# EAGLE design EBF31A production rev 3.1 (EAGLE 7.7.0)
Electronic Battery Feed Circuit taken from Altec 8480-2 by Clint Gilliland
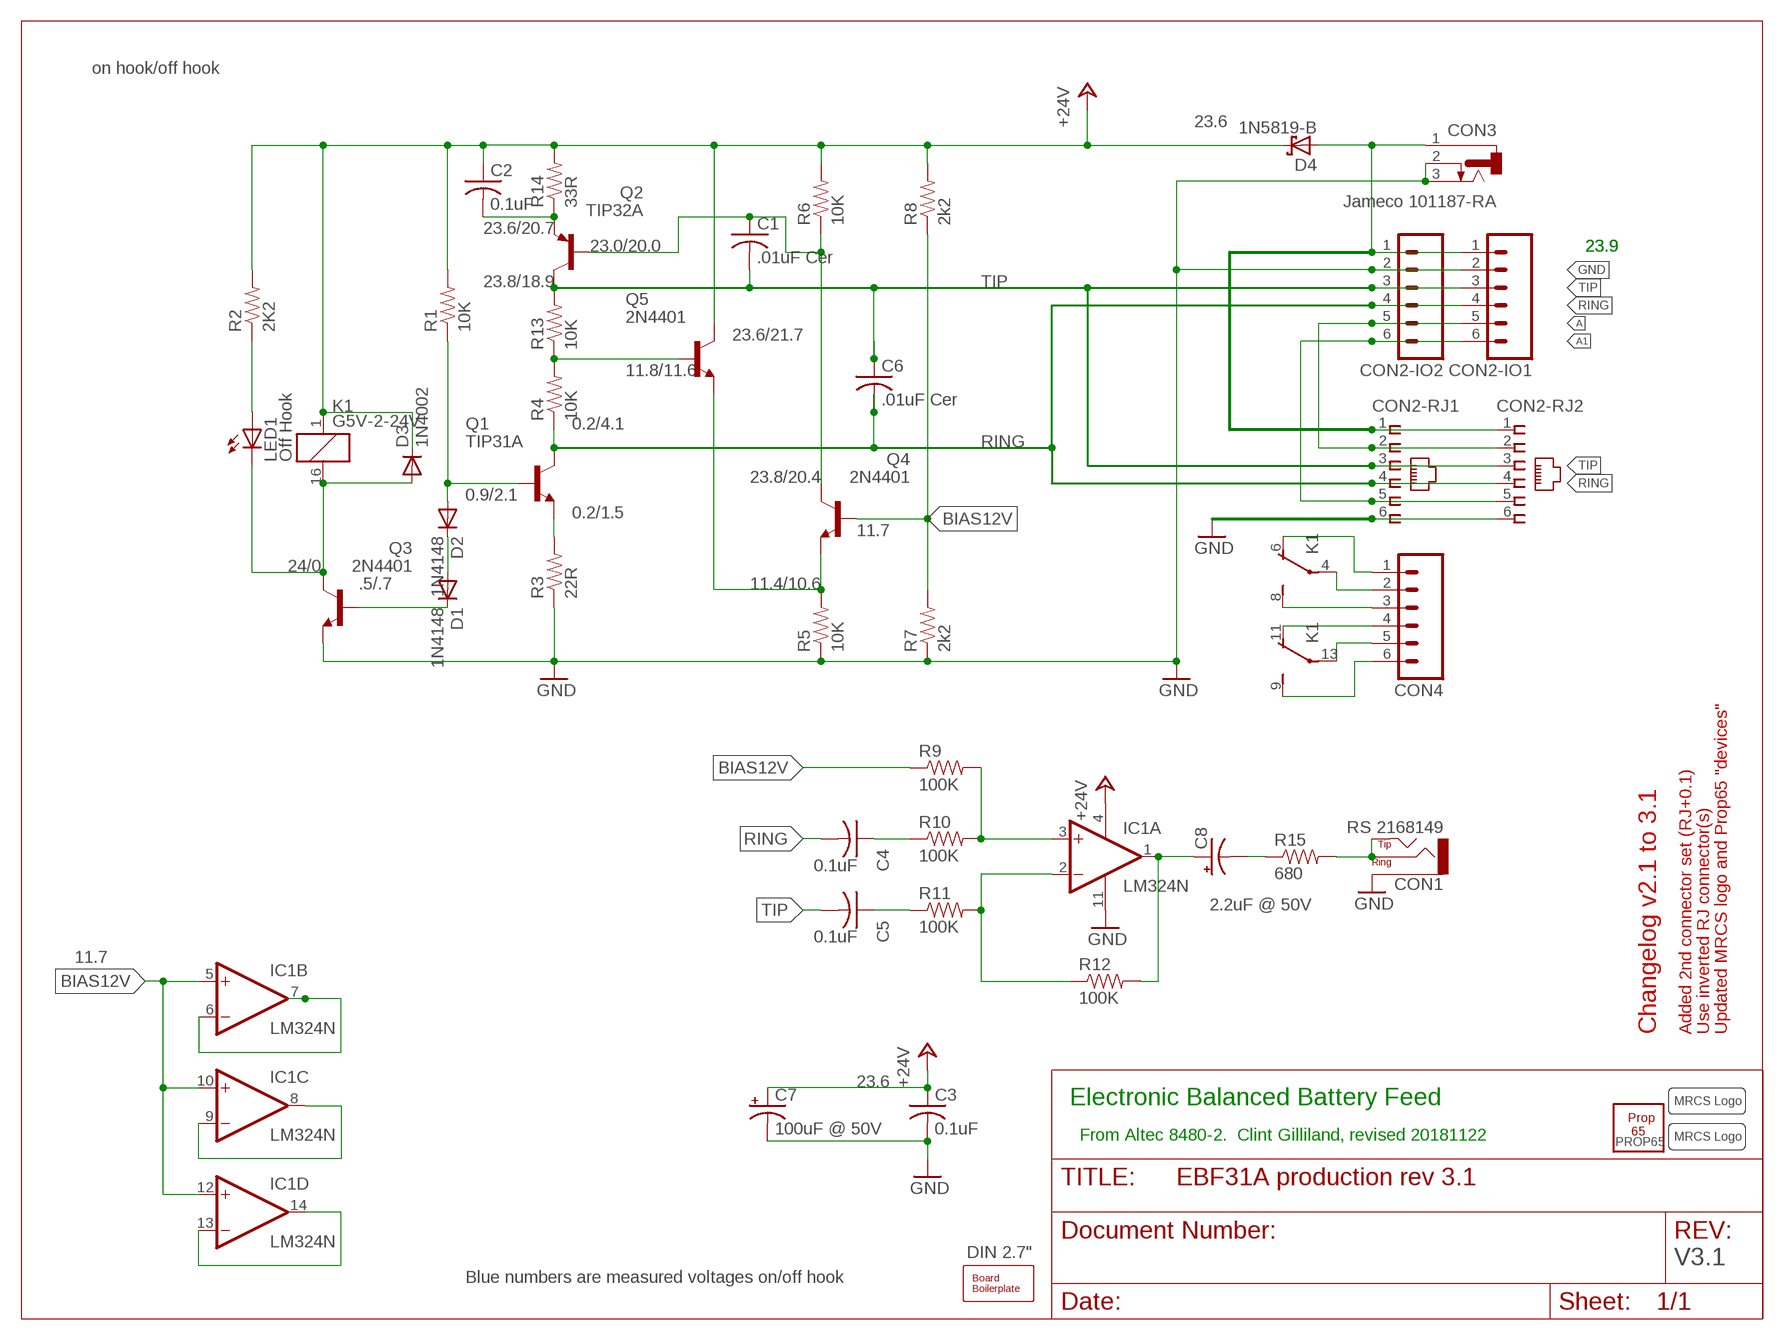
[diagram p0: schematic, sheet 1]

## Parts
C1  .01uF Cer  C-US025-030X050  [C025-030X050]
C2  0.1uF  C-US025-030X050  [C025-030X050]
C3  0.1uF  C-US025-030X050  [C025-030X050]
C4  0.1uF  C-US025-030X050  [C025-030X050]
C5  0.1uF  C-US025-030X050  [C025-030X050]
C6  .01uF Cer  C-US025-030X050  [C025-030X050]
C7  100uF @ 50V  CPOL-USE3.5-10  [E3,5-10]
C8  2.2uF @ 50V  CPOL-USE2-5  [E2-5]
CON1  RS 2168149  CONNECTOR-AUDIO3.5MM-ADAMTECH  [AUDIO-JACK-3.5MM_STEREO]
CON2-IO1  M06FEMALE_LOCK  [1X06_FEMALE_LOCK.010]
CON2-IO2  M06FEMALE_LOCK  [1X06_FEMALE_LOCK.010]
CON2-RJ1  CONNECTOR-RJ25-43860-2-MOLEX  [RJ25-INVERTED]
CON2-RJ2  CONNECTOR-RJ25-43860-2-MOLEX  [RJ25-INVERTED]
CON3  Jameco 101187-RA  CONNECTOR-DC-POWER-RA  [DCJ0202]
CON4  M06FEMALE_LOCK  [1X06_FEMALE_LOCK.010]
D1  1N4148  DIODE1N4148  [DIODE-1N4148]
D2  1N4148  DIODE1N4148  [DIODE-1N4148]
D3  1N4002  DIODE1N4148  [DIODE-1N4148]
D4  1N5819-B  [DO41-7.6]
IC1  LM324N  [DIL14]
K1  G5V-2-24V  G5V-2  [G5V-2]
LED1  Off Hook  LED3MM  [LED3MM]
Q1  TIP31A  TIP31C  [TO220]
Q2  TIP32A  TIP30  [TO220]
Q3  2N4401  BC317-NPN-TO92-EBC  [TO92-EBC]
Q4  2N4401  BC317-NPN-TO92-EBC  [TO92-EBC]
Q5  2N4401  BC317-NPN-TO92-EBC  [TO92-EBC]
R1  10K  RESISTORPTH-1/4W  [AXIAL-0.4]
R2  2K2  RESISTORPTH-1/4W  [AXIAL-0.4]
R3  22R  RESISTORPTH-1/4W  [AXIAL-0.4]
R4  10K  RESISTORPTH-1/4W  [AXIAL-0.4]
R5  10K  RESISTORPTH-1/4W  [AXIAL-0.4]
R6  10K  RESISTORPTH-1/4W  [AXIAL-0.4]
R7  2k2  RESISTORPTH-1/4W  [AXIAL-0.4]
R8  2k2  RESISTORPTH-1/4W  [AXIAL-0.4]
R9  100K  RESISTORPTH-1/4W  [AXIAL-0.4]
R10  100K  RESISTORPTH-1/4W  [AXIAL-0.4]
R11  100K  RESISTORPTH-1/4W  [AXIAL-0.4]
R12  100K  RESISTORPTH-1/4W  [AXIAL-0.4]
R13  10K  RESISTORPTH-1/4W  [AXIAL-0.4]
R14  33R  RESISTORPTH-1/4W  [AXIAL-0.4]
R15  680  RESISTORPTH-1/4W  [AXIAL-0.4]
U$1  BOARD  BOARD69X100MRCS  [BOARD-DINRAIL-2.71IN-MRCS]
U$2  MRCS-LOGOBOT-LARGE  [MRCS-LOGO]
U$3  MRCS-LOGOBOT-LARGE  [MRCS-LOGO]
U$4  PROP65  [PROP65]

## Nets
+24V: C2.1 C3.1 C7.+ D3.C D4.C IC1.4(P:V+) K1.1 Q5.C R1.P$2 R2.P$2 R6.P$2 R8.P$2 R14.P$2
A: CON2-IO1.5 CON2-IO2.5 CON2-RJ1.2 CON2-RJ2.2
A1: CON2-IO1.6 CON2-IO2.6 CON2-RJ1.5 CON2-RJ2.5
BIAS12V: IC1.5(B:+IN) IC1.10(C:+IN) IC1.12(D:+IN) Q4.B R7.P$2 R8.P$1 R9.P$1
GND: C3.2 C7.- CON1.GND(SLEEVE) CON2-IO1.2 CON2-IO2.2 CON2-RJ1.6 CON2-RJ2.6 CON3.2 CON3.3 IC1.11(P:V-) Q3.E R3.P$1 R5.P$1 R7.P$1
N$1: C2.2 Q2.3(E) R14.P$1
N$2: CON4.2 K1.4(1:P)
N$3: Q5.B R4.P$2 R13.P$1
N$4: IC1.2(A:-IN) R11.P$2 R12.P$1
N$5: Q1.3(E) R3.P$2
N$6: LED1.A R2.P$1
N$7: CON2-IO1.1 CON2-IO2.1 CON2-RJ1.1 CON2-RJ2.1 CON3.1 D4.A
N$8: Q4.E Q5.E R5.P$2
N$9: C1.1 Q2.1(B) Q4.C R6.P$1
N$10: D1.C Q3.B
N$11: D1.A D2.C
N$12: D2.A Q1.1(B) R1.P$1
N$13: D3.A K1.16 LED1.K(C) Q3.C
N$15: IC1.13(D:-IN) IC1.14(D:OUT)
N$16: CON4.6 K1.9(2:S)
N$17: CON4.1 K1.6(1:O)
N$18: CON4.3 K1.8(1:S)
N$19: C5.1 R11.P$1
N$20: C8.+ IC1.1(A:OUT) R12.P$2
N$21: CON4.5 K1.13(2:P)
N$22: IC1.6(B:-IN) IC1.7(B:OUT)
N$23: CON4.4 K1.11(2:O)
N$25: C8.- R15.P$1
N$27: CON1.RING CON1.TIP R15.P$2
N$28: IC1.3(A:+IN) R9.P$2 R10.P$2
N$31: C4.1 R10.P$1
N$33: IC1.8(C:OUT) IC1.9(C:-IN)
RING: C4.2 C6.2 CON2-IO1.4 CON2-IO2.4 CON2-RJ1.4 CON2-RJ2.4 Q1.2(C) R4.P$1
TIP: C1.2 C5.2 C6.1 CON2-IO1.3 CON2-IO2.3 CON2-RJ1.3 CON2-RJ2.3 Q2.2(C) R13.P$2

## Notes on the sheet
- on hook/off hook
- 23.6
- 23.6/20.7
- 23.0/20.0 | 23.9 | 23.9
- 23.8/18.9
- 23.6/21.7
- 11.8/11.6
- 0.2/4.1
- 23.8/20.4
- 0.9/2.1
- 0.2/1.5
- 11.7
- 24/0
- .5/.7 | 11.4/10.6
- 11.7
- Changelog v2.1 to 3.1 | Added 2nd connector set (RJ+0.1) | Use inverted RJ connector(s) | Updated MRCS logo and Prop65 "devices"
- 23.6
- Electronic Balanced Battery Feed
- From Altec 8480-2.  Clint Gilliland, revised 20181122
- DIN 2.7"
- V3.1
- Blue numbers are measured voltages on/off hook

## Library data of the parts
C1-C6 = rcl:C-US: CAPACITOR, American symbol
C7 C8 = rcl:CPOL-US: POLARIZED CAPACITOR, American symbol
CON1 = SPCoast:CONNECTOR-AUDIO: 3.5mm Audio Jack Simple 3.5mm common PCB mount audio jack. SKU: PRT-08032
CON2-IO1 CON2-IO2 CON4 = SparkFun-Connectors:M06: Header 6 Standard 6-pin 0.1" header. Use with straight break away headers (SKU : PRT-00116), right angle break away headers (PRT-00553), swiss pins (PRT-00743), machine pins (PRT-00117), and female headers (PRT-00115). Molex polarized connector foot print use with SKU : PRT-08094 with associated crimp pins and housings. NOTES ON THE VARIANTS LOCK and LOCK_LONGPADS... This footprint was designed to help hold the alignment of a through-hole component (i.e. 6-pin header) while soldering it into place. You may notice that each hole has been shifted either up or down by 0.005 of an inch from it's more standard position (which is a perfectly straight line). This slight alteration caused the pins (the squares in the middle) to touch the edges of the holes. Because they are alternating, it causes a "brace" to hold the component in place. 0.005 has proven to be the perfect amount of "off-center" position when using our standard breakaway headers. Although looks a little odd when you look at the bare footprint, once you have a header in there, the alteration is very hard to notice. Also,if you push a header all the way into place, it is covered up entirely on the bottom side. This idea of altering the position of holes to aid alignment will be further integrated into the Sparkfun Library for other footprints. It can help hold any component with 3 or more connection pins.
CON2-RJ1 CON2-RJ2 = SPCoast:CONNECTOR-RJ25: AMP connector
CON3 = SPCoast:CONNECTOR-DC-POWER: DC POWER JACK Source: DCJ0202.pdf
D1-D3 = SparkFun-DiscreteSemi:DIODE: Diode These are standard reverse protection diodes and small signal diodes. SMA package can handle up to about 1A. SOD-323 can handle about 200mA. What the SOD-323 package when ordering, there are some mfgs out there that are 5-pin packages.
D4 = diode:1N581*: 1.0A SCHOTTKY BARRIER RECTIFIER Source: http://www.diodes.com/datasheets/ds23001.pdf
IC1 = linear:LM324: OP AMP
K1 = relay:G5V-2: OMRON PCB Relay Source: http://www.omron.com/ecb/products/pdf/en-g5v2.pdf; MPN: G5V-2 5DC; OC_FARNELL: 9949488; OC_NEWARK: 78K5703
LED1 = SparkFun-LED:LED: LEDs Standard schematic elements and footprints for 5mm, 3mm, 1206, and 0603 sized LEDs. 5mm - Spark Fun Electronics SKU : COM-00529 (and others)
Q1 = transistor-npn:TIP31C*: NPN Transistor
Q2 = transistor-pnp:TIP30: PNP Transistor
Q3-Q5 = SPCoast:*-NPN-: NPN Transistror BF959 corrected 2008.03.06
R1-R15 = SparkFun-Resistors:RESISTOR: Resistor Basic schematic elements and footprints for 0603, 1206, and PTH resistors.
U$1 = SPCoast:BOARD
U$2 U$3 = SPCoast:MRCS-LOGO
U$4 = SPCoast:PROP65

## Board
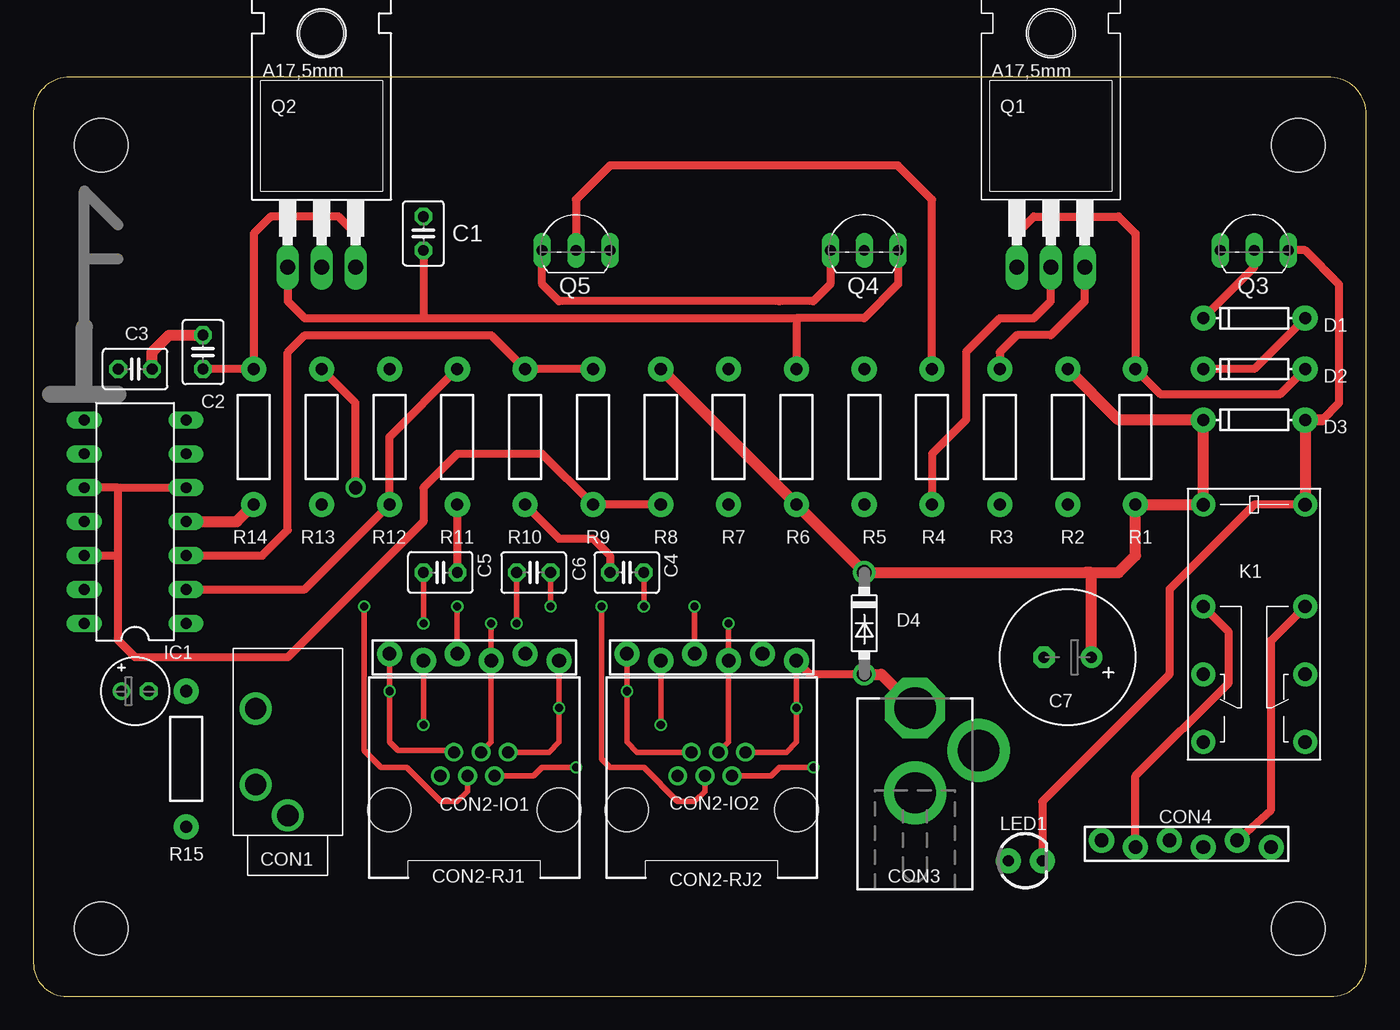
[diagram p1: board, top side]
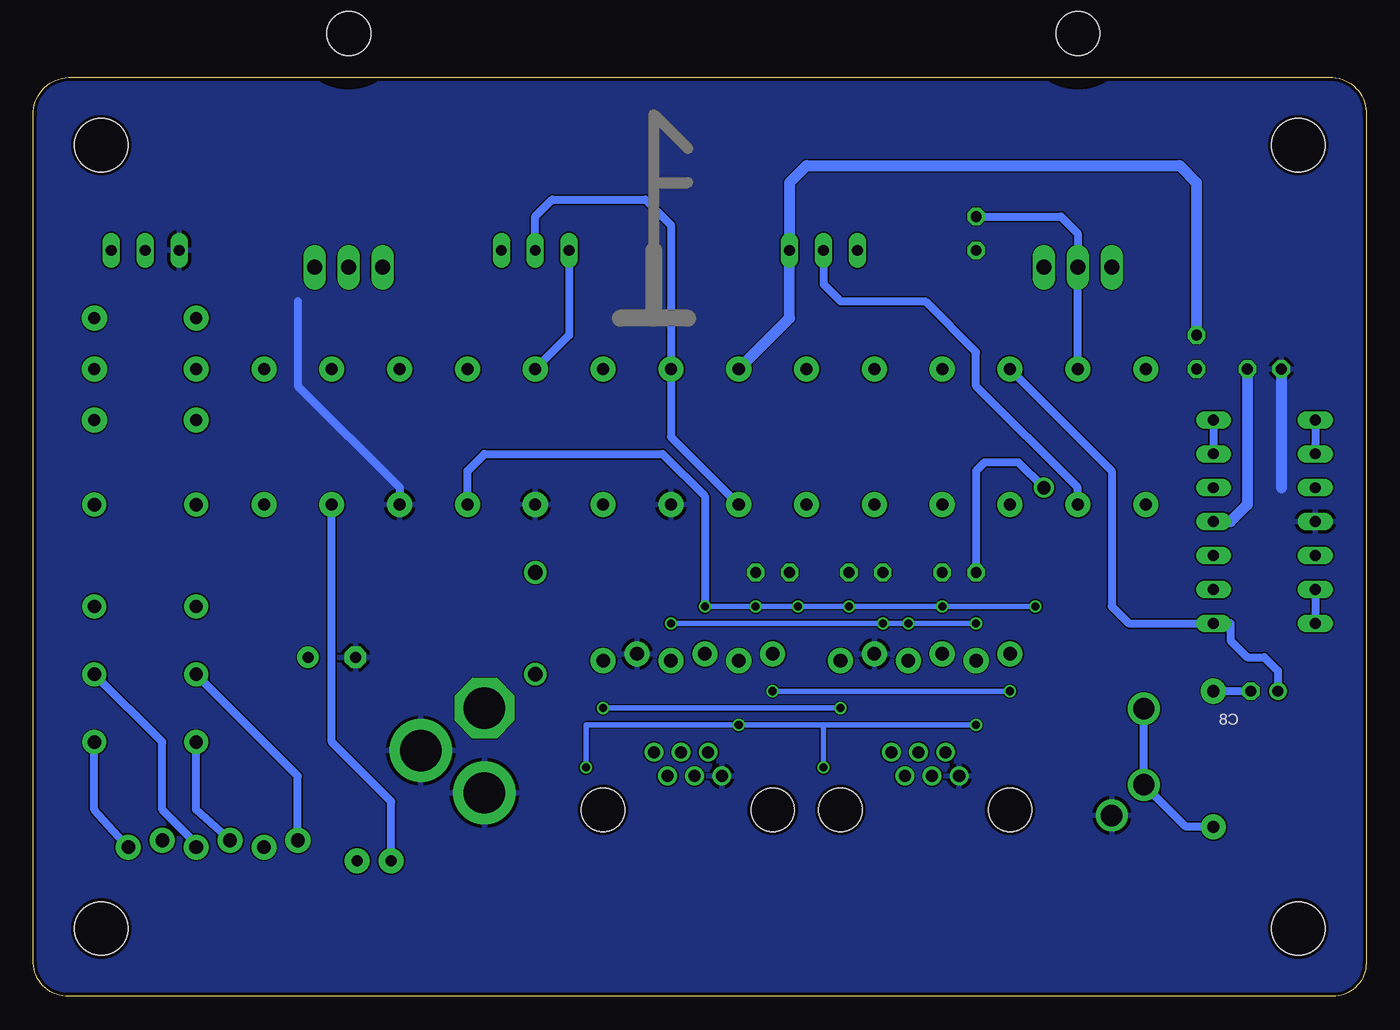
[diagram p2: board, bottom side, seen from below]

Size 99.82 x 68.83 mm. Coordinates in mm from the lower left corner, seen from the top.
Copper layers (1*16): Top 0.035mm / dielectric 1.5mm / Bottom 0.035mm
Design rules "SeeedStudio_2layer_DRU_no_angle_2018-plocher": minimum track width 6mil, minimum drill 12mil, track to track 4mil, track to pad 4mil, pad to pad 12mil, via to via 12mil, smd to smd 0mil, copper to edge 10mil, drill to drill 10mil, minimum pad ring 10mil, minimum via ring 6mil, stop-mask expansion 2mil, vias tented up to drill 100mil, thermal gap 10mil

### Footprints (pad centres in the part's own frame; a part is rotated, then mirrored left to right if it is on the bottom)
C025-030X050 = drill 0.813 octagon: 1 -1.27,0; 2 1.27,0
E3,5-10 = drill 0.813 pad 1.6: + -1.778,0 | drill 0.813 pad 1.6 octagon: - 1.778,0
E2-5 = drill 0.813 pad 1.27: + -1.016,0 | drill 0.813 pad 1.27 octagon: - 1.016,0
AUDIO-JACK-3.5MM_STEREO = drill 1.6: GND -5.5,0; RING 2.5,2.4; TIP -3.2,2.4
1X06_FEMALE_LOCK.010 = drill 1.016 pad 1.88: 1 0,0.254; 2 2.54,-0.254; 3 5.08,0.254; 4 7.62,-0.254; 5 10.16,0.254; 6 12.7,-0.254
RJ25-INVERTED = drill 0.9 pad 1.4: 1 2.54,4.318; 2 1.524,2.54; 3 0.508,4.318; 4 -0.508,2.54; 5 -1.524,4.318; 6 -2.54,2.54 | hole 3.251: -6.35,0; 6.35,0
DCJ0202 = drill 3.1 pad 4.5 octagon: 1 0,3.175 | drill 3.1 pad 4.7: 2 4.763,0; 3 0,-3.175
DIODE-1N4148 = drill 0.9 pad 1.88: A -3.81,0; C 3.81,0
DO41-7.6 = drill 1.1 pad 1.7: A 3.81,0; C -3.81,0
DIL14 = drill 0.813 long: 1 -7.62,-3.81; 2 -5.08,-3.81; 3 -2.54,-3.81; 4 0,-3.81; 5 2.54,-3.81; 6 5.08,-3.81; 7 7.62,-3.81; 8 7.62,3.81; 9 5.08,3.81; 10 2.54,3.81; 11 0,3.81; 12 -2.54,3.81; 13 -5.08,3.81; 14 -7.62,3.81
G5V-2 = drill 1 pad 1.8: 1 -8.89,-3.81; 4 -1.27,-3.81; 6 3.81,-3.81; 8 8.89,-3.81; 9 8.89,3.81; 11 3.81,3.81; 13 -1.27,3.81; 16 -8.89,3.81
LED3MM = drill 0.813 pad 1.88: A -1.27,0; K 1.27,0
TO220 = drill 1.118 long: 1 -2.54,-6.35; 2 0,-6.35; 3 2.54,-6.35 | hole 3.302: 0,11.176
TO92-EBC = drill 0.813 long: B 0,-1.27; C 2.54,-1.27; E -2.54,-1.27
AXIAL-0.4 = drill 0.9 pad 1.88: P$1 -5.08,0; P$2 5.08,0
BOARD-DINRAIL-2.71IN-MRCS = hole 4: 94.742,5.08; 5.08,63.754; 94.742,63.754; 5.08,5.08

### Placement (x,y rotation side)
C1  29.21,57.15 90 top
C2  12.7,48.26 270 top
C3  7.62,46.99 180 top
C4  44.45,31.75 0 top
C5  30.48,31.75 180 top
C6  37.47,31.75 0 top
C7  77.47,25.4 180 top
C8  7.62,22.86 0 top
CON1  19.05,19.05 90 top
CON2-IO1  39.37,25.4 180 top
CON2-IO2  57.15,25.4 180 top
CON2-RJ1  33.02,13.97 0 top
CON2-RJ2  50.8,13.97 0 top
CON3  66.04,18.41 0 top
CON4  80.01,11.43 0 top
D1  91.44,50.8 180 top
D2  91.44,46.99 180 top
D3  91.44,43.18 180 top
D4  62.23,27.94 270 top
IC1  7.62,35.56 90 top
K1  91.44,27.94 270 top
LED1  74.3,10.16 0 top
Q1  76.2,60.96 0 top
Q2  21.59,60.96 0 top
Q3  91.44,57.15 0 top
Q4  62.23,57.15 0 top
Q5  40.64,57.15 0 top
R1  82.55,41.91 270 top
R2  77.47,41.91 90 top
R3  72.39,41.91 90 top
R4  67.31,41.91 90 top
R5  62.23,41.91 90 top
R6  57.15,41.91 270 top
R7  52.07,41.91 90 top
R8  46.99,41.91 90 top
R9  41.91,41.91 90 top
R10  36.83,41.91 90 top
R11  31.75,41.91 90 top
R12  26.67,41.91 90 top
R13  21.59,41.91 90 top
R14  16.51,41.91 270 top
R15  11.43,17.78 270 top
U$1  0,0 0 top
U$2  3.81,45.09 0 top
U$3  53.34,50.8 0 bottom
U$4  67.31,39.37 0 bottom

### Tracks (layer width: path | path; a pad name or v marks a point on that pad's centre or on a via)
+24V
  Top 0.813: R2.P$2 81.28,43.18 D3.C K1.1 R1.P$2 82.55,33.02 81.28,31.75 78.74,31.75 | IC1.4 15.24,35.56 R14.P$2 | C3.1 8.89,48.26 10.16,49.53 C2.1 | R8.P$2 R6.P$2 D4.C 78.74,31.75 | C7.+ 79.25,31.75 78.74,31.75
  Bottom 0.813: C2.1 12.7,60.96 13.97,62.23 41.91,62.23 43.18,60.96 Q5.C 43.18,50.8 R8.P$2 | C3.1 8.89,36.83 10.16,35.56 IC1.4
A  (via drill 0.6)
  Top 0.406: CON2-IO2.5 v46.99,20.32 | v29.21,20.32 CON2-IO1.5 | CON2-RJ1.2 37.47,16.51 38.1,17.14 v40.64,17.14 | v58.42,17.14 55.88,17.14 55.25,16.51 CON2-RJ2.2
  Bottom 0.406: 40.64,20.32 v46.99,20.32 58.42,20.32 v58.42,17.14 | 40.64,20.32 v29.21,20.32 | v40.64,17.14 40.64,20.32
A1  (via drill 0.6)
  Top 0.406: CON2-IO1.6 v26.67,22.86 26.67,19.05 27.31,18.41 31.37,18.41 CON2-RJ1.5 | CON2-IO2.6 v44.45,22.86 44.45,19.05 45.21,18.29 CON2-RJ2.5
  Bottom 0.406: v26.67,22.86 v44.45,22.86
BIAS12V
  Top 0.61: R8.P$1 R9.P$1 38.1,40.64 31.75,40.64 29.21,38.1 29.21,35.56 19.05,25.4 7.62,25.4 6.35,26.67 6.35,33.02 | IC1.12 6.35,33.02 | 6.35,33.02 6.35,38.1 | 6.35,38.1 IC1.10 | 6.35,38.1 IC1.5
  Bottom 0.61: R8.P$1 52.07,41.91 R7.P$2 52.07,57.78 53.98,59.69 60.96,59.69 62.23,58.42 Q4.B
GND
  Bottom 0.61: 80.01,52.07 80.01,45.72 72.39,38.1 R3.P$1
  Bottom 0.813: C3.2 6.35,38.1
  pour Bottom: 100.33,0 0,0 0,68.58 100.33,68.58
N$1
  Top 0.61: C2.2 R14.P$1 16.51,57.15 17.78,58.42 22.86,58.42 24.13,57.15 Q2.3
N$2
  Top 0.61: CON4.2 82.55,16.51 89.54,23.5 89.54,27.3 K1.4
N$3
  Top 0.61: R4.P$2 67.31,59.69 64.77,62.23 43.18,62.23 40.64,59.69 Q5.B
  Bottom 0.61: R13.P$1 21.59,38.1 29.21,45.72 29.21,48.26 33.02,52.07 39.37,52.07 40.64,53.34 Q5.B
N$4
  Top 0.61: IC1.2 20.32,30.48 R12.P$1 26.67,41.91 R11.P$2
N$5
  Top 0.61: Q1.3 78.74,52.07 76.2,49.53 73.66,49.53 72.39,48.26 R3.P$2
N$6
  Bottom 0.61: LED1.A 73.03,14.61 77.47,19.05 R2.P$1
N$7  (via drill 0.6)
  Top 0.406: CON2-IO2.1 v57.15,21.59 57.15,19.05 56.39,18.29 CON2-RJ2.1 | CON2-IO1.1 v39.37,21.59 39.37,19.05 38.61,18.29 CON2-RJ1.1
  Top 0.61: D4.A 58.17,24.13 CON2-IO2.1
  Top 0.813: D4.A 63.5,24.13 CON3.1
  Bottom 0.406: v57.15,21.59 v39.37,21.59
N$8
  Top 0.61: Q5.E 38.1,53.34 39.37,52.07 55.88,52.07 58.42,52.07 59.69,53.34 Q4.E
  Bottom 0.61: Q4.E 59.69,49.53 R5.P$2
N$9
  Top 0.61: Q2.1 19.05,52.07 20.32,50.8 29.21,50.8 | 29.21,50.8 57.15,50.8 | 57.15,50.8 R6.P$1 | Q4.C 64.77,53.34 62.23,50.8 57.15,50.8 | C1.1 29.21,50.8
N$10
  Top 0.61: D1.C 91.44,54.61 Q3.B
N$11
  Top 0.61: D1.A 91.44,46.99 D2.C
N$12
  Top 0.61: D2.A 93.35,45.09 84.46,45.09 R1.P$1 82.55,57.15 81.28,58.42 74.93,58.42 73.66,57.15 Q1.1
N$13
  Top 0.61: 96.52,43.18 97.79,44.45 97.79,53.34 95.25,55.88 Q3.C | K1.16 91.44,36.83 85.09,30.48 85.09,24.13 75.57,14.61 LED1.K
  Top 0.813: K1.16 D3.A 96.52,43.18
N$15
  Bottom 0.61: IC1.13 IC1.14
N$16
  Bottom 0.61: CON4.6 95.25,13.97 K1.9
N$17
  Bottom 0.61: CON4.1 80.01,16.51 K1.6
N$18
  Bottom 0.61: CON4.3 87.63,13.97 K1.8
N$19
  Top 0.61: R11.P$1 C5.1
N$20
  Bottom 0.61: R12.P$2 19.05,39.37 19.05,29.21 17.78,27.94 IC1.1 10.16,27.94 10.16,26.67 8.89,25.4 7.62,25.4 6.61,24.38 C8.+
N$21
  Top 0.61: CON4.5 92.71,13.97 92.71,26.67 K1.13
N$22
  Bottom 0.61: IC1.7 IC1.6
N$23
  Bottom 0.61: CON4.4 87.63,11.43 90.17,13.97 90.17,19.05 K1.11
N$25
  Bottom 0.61: C8.- R15.P$1
N$27
  Bottom 0.61: R15.P$2 13.5,12.7 CON1.TIP CON1.RING
N$28
  Top 0.61: R9.P$2 R10.P$2 34.29,49.53 20.32,49.53 19.05,48.26 19.05,34.92 17.15,33.02 IC1.3
N$31
  Top 0.61: R10.P$1 39.37,34.29 41.91,34.29 43.18,33.02 C4.1
N$33
  Bottom 0.61: IC1.8 IC1.9
RING  (via drill 0.6)
  Top 0.406: CON2-IO1.4 v31.75,29.21 | v49.53,29.21 CON2-IO2.4 | C6.2 v38.74,29.21 | C4.2 v45.72,29.21 | v24.77,29.21 24.77,18.41 26.04,17.14 27.94,17.14 30.48,14.61 31.75,14.61 32.51,15.37 CON2-RJ1.4 | CON2-RJ2.4 50.29,15.37 49.53,14.61 48.26,14.61 45.72,17.14 43.18,17.14 42.55,17.78 v42.55,29.21
  Top 0.61: R4.P$1 67.31,40.64 69.85,43.18 69.85,48.26 72.39,50.8 74.93,50.8 76.2,52.07 Q1.2
  Bottom 0.406: v49.53,29.21 v45.72,29.21 v42.55,29.21 v38.74,29.21 v31.75,29.21 v24.77,29.21
  Bottom 0.61: R4.P$1 67.31,39.37 66.04,40.64 52.71,40.64 49.53,37.47 v49.53,29.21
TIP  (via drill 0.6, 1)
  Top 0.406: CON2-RJ1.3 34.29,19.05 CON2-IO1.3 v34.29,27.94 | CON2-RJ2.3 52.07,19.05 CON2-IO2.3 v52.07,27.94 | C6.1 v36.2,27.94 | C5.2 v29.21,27.94
  Top 0.61: v24.13,38.1 24.13,44.45 R13.P$2
  Bottom 0.406: v52.07,27.94 v36.2,27.94 v34.29,27.94 v29.21,27.94
  Bottom 0.61: R13.P$2 Q2.2 21.59,57.15 22.86,58.42 C1.2 | v24.13,38.1 26.04,40.01 28.58,40.01 29.21,39.37 C5.2

### Text on the board
tDocu: V3.1 | 2018.11 | Electronic Battery Feed / EBF31A replacement | Clint Gilliland / Seth Neumann / John Plocher | Ring | +24v | Tip | Gnd | A1 | A | Ring | Tip | Gnd | +24v | A1 | A | nc c no | nc c no | Audio | To Phones | +24v | Relay
bDocu: Electronic Battery Feed - EBF31A